# EAGLE design trickle2.bpcb (EAGLE 5.04)
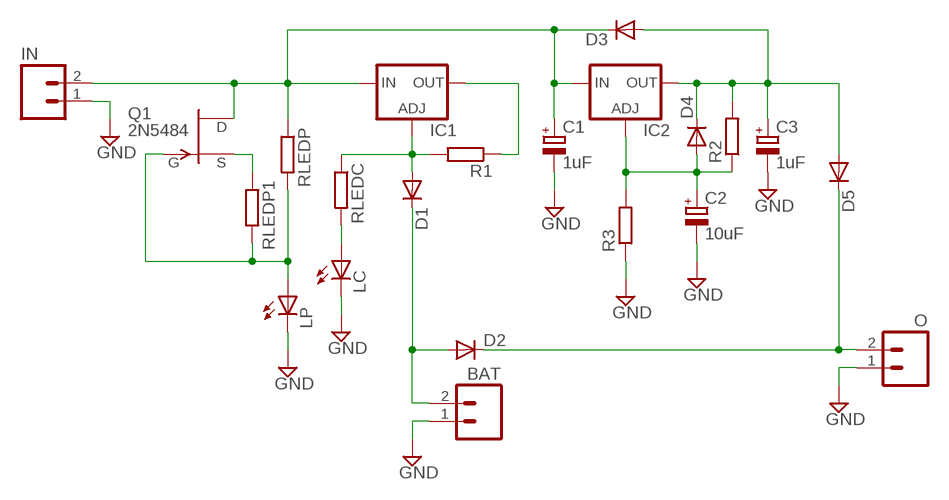
[diagram p0: schematic, sheet 1]

## Parts
BAT  M02PTH  [1X02]
C1  1uF  CPOL-EUE2.5-5  [E2,5-5]
C2  10uF  CPOL-EUE2.5-7  [E2,5-7]
C3  1uF  CPOL-EUE2.5-5  [E2,5-5]
D1  1N4446  [DO35-10]
D2  1N4446  [DO35-10]
D3  1N4446  [DO35-10]
D4  1N4446  [DO35-10]
D5  1N4446  [DO35-10]
IC1  LM317L  [317L]
IC2  LM317L  [317L]
IN  M02PTH  [1X02]
LC  LED3MM  [LED3MM]
LP  LED3MM  [LED3MM]
O  M02PTH  [1X02]
Q1  2N5484  2N3819  [TO92]
R1  R-EU_0207/10  [0207/10]
R2  R-EU_0207/10  [0207/10]
R3  R-EU_0207/10  [0207/10]
RLEDC  R-EU_0207/10  [0207/10]
RLEDP  R-EU_0207/10  [0207/10]
RLEDP1  R-EU_0207/10  [0207/10]

## Nets
GND: BAT.1 C1.- C2.- C3.- IN.1 LC.K(C) LP.K(C) O.1 R3.1
N$1: LP.A Q1.2(G) RLEDP1.2 RLEDP.2
N$2: LC.A RLEDC.2
N$3: BAT.2 D1.C D2.A
N$4: D1.A IC1.1(ADJ) R1.2 RLEDC.1
N$5: Q1.3(S) RLEDP1.1
N$6: D2.C D5.C O.2
N$7: C2.+ D4.A IC2.1(ADJ) R2.1 R3.2
N$9: IC1.2(OUT) R1.1
REG+: C3.+ D3.A D4.C D5.A IC2.2(OUT) R2.2
VCC: C1.+ D3.C IC1.3(IN) IC2.3(IN) IN.2 Q1.1(D) RLEDP.1

## Library data of the parts
BAT IN O = SparkFun:M02: Header 2 Standard 2-pin 0.1" header. Use with straight break away headers (SKU : PRT-00116), right angle break away headers (PRT-00553), swiss pins (PRT-00743), machine pins (PRT-00117), and female headers (PRT-00115). Molex polarized connector foot print use with SKU : PRT-08233 with associated crimp pins and housings.
C1-C3 = rcl:CPOL-EU: POLARIZED CAPACITOR, European symbol
D1-D5 = diode:1N4446: DIODE high speed (Philips)
IC1 IC2 = v-reg:LM317L: VOLTAGE REGULATOR
LC LP = led:LED: LED OSRAM: - CHIPLED LG R971, LG N971, LY N971, LG Q971, LY Q971, LO R971, LY R971 LH N974, LH R974 LS Q976, LO Q976, LY Q976 LO Q996 - Hyper CHIPLED LW Q18S LB Q993, LB Q99A, LB R99A - SideLED LS A670, LO A670, LY A670, LG A670, LP A670 LB A673, LV A673, LT A673, LW A673 LH A674 LY A675 LS A676, LA A676, LO A676, LY A676, LW A676 LS A679, LY A679, LG A679 - Hyper Micro SIDELED® LS Y876, LA Y876, LO Y876, LY Y876 LT Y87S - SmartLED LW L88C, LW L88S LB L89C, LB L89S, LG L890 LS L89K, LO L89K, LY L89K LS L896, LA L896, LO L896, LY L896 - TOPLED LS T670, LO T670, LY T670, LG T670, LP T670 LSG T670, LSP T670, LSY T670, LOP T670, LYG T670 LG T671, LOG T671, LSG T671 LB T673, LV T673, LT T673, LW T673 LH T674 LS T676, LA T676, LO T676, LY T676, LB T676, LH T676, LSB T676, LW T676 LB T67C, LV T67C, LT T67C, LS T67K, LO T67K, LY T67K, LW E67C LS E67B, LA E67B, LO E67B, LY E67B, LB E67C, LV E67C, LT E67C LW T67C LS T679, LY T679, LG T679 LS T770, LO T770, LY T770, LG T770, LP T770 LB T773, LV T773, LT T773, LW T773 LH T774 LS E675, LA E675, LY E675, LS T675 LS T776, LA T776, LO T776, LY T776, LB T776 LHGB T686 LT T68C, LB T68C - Hyper Mini TOPLED® LB M676 - Mini TOPLED Santana® LG M470 LS M47K, LO M47K, LY M47K Source: http://www.osram.convergy.de/
Q1 = transistor-fet:2N3819: N-Channel Junction FET
R1-R3 RLEDC RLEDP RLEDP1 = rcl:R-EU_: RESISTOR, European symbol

## Board
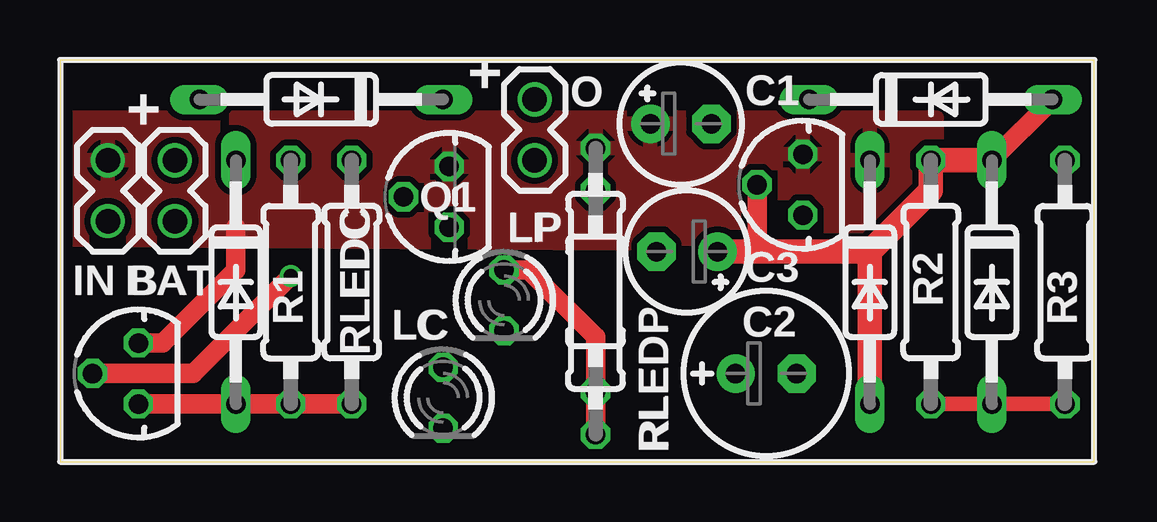
[diagram p1: board, top side]
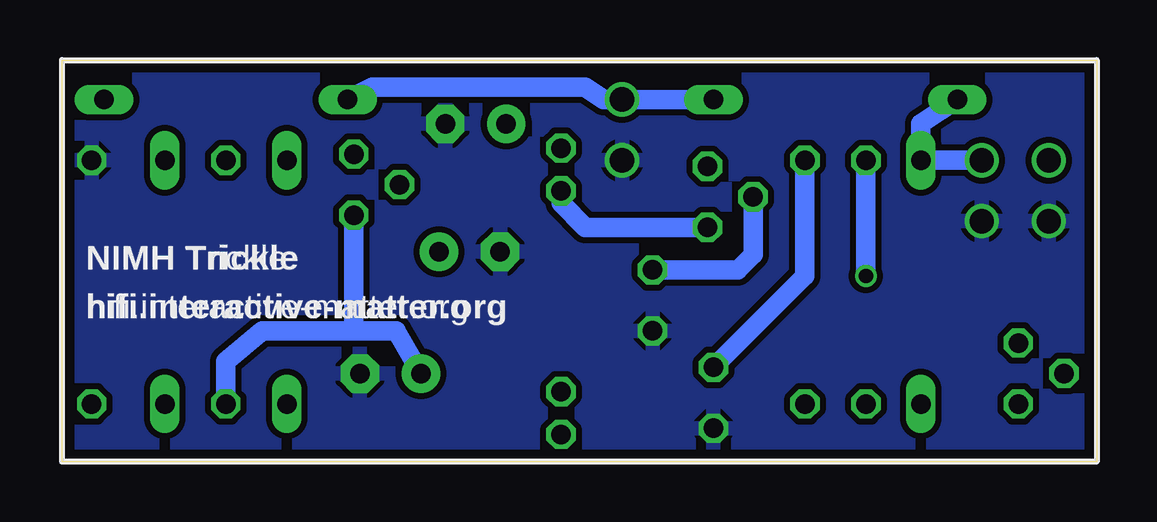
[diagram p2: board, bottom side, seen from below]

Size 43.1 x 16.75 mm. Coordinates in mm from the lower left corner, seen from the top.
Outline: 0,0 43.1,0 43.1,16.75 0,16.75 0,0
Copper layers (1*16): Top 0.035mm / dielectric 1.5mm / Bottom 0.035mm
Design rules "PCB-POOL": minimum track width 6mil, minimum drill 12mil, track to track 6mil, track to pad 6mil, pad to pad 6mil, via to via 6mil, smd to smd 6mil, copper to edge 20mil, drill to drill 8mil, minimum pad ring 8mil, minimum via ring 6mil, stop-mask expansion 3mil, vias tented up to drill 0mil, thermal gap 8mil

### Footprints (pad centres in the part's own frame; a part is rotated, then mirrored left to right if it is on the bottom)
1X02 = drill 1.016 round: 1 0,0; 2 2.54,0
E2,5-5 = drill 0.813 pad 1.6 round: + -1.27,0 | drill 0.813 pad 1.6 octagon: - 1.27,0
E2,5-7 = drill 0.813 pad 1.6 round: + -1.27,0 | drill 0.813 pad 1.6 octagon: - 1.27,0
DO35-10 = drill 0.813 long: A 5.08,0; C -5.08,0
317L = drill 0.813 octagon: 1 -1.27,0; 2 0,1.905; 3 1.27,0
LED3MM = drill 0.813 octagon: A -1.27,0; K 1.27,0
TO92 = drill 0.813 octagon: 1 1.27,0; 2 0,1.905; 3 -1.27,0
0207/10 = drill 0.813 octagon: 1 -5.08,0; 2 5.08,0

### Placement (x,y rotation side)
BAT  4.79,10.03 90 top
C1  25.87,14.09 0 top
C2  29.43,3.68 0 top
C3  26.12,8.76 180 top
D1  7.33,7.49 270 top
D2  10.88,15.11 180 top
D3  33.74,7.49 270 top
D4  38.82,7.49 270 top
D5  36.28,15.11 0 top
IC1  3.26,3.68 90 top
IC2  30.95,11.55 90 top
IN  1.99,10.03 90 top
LC  15.96,2.66 270 top
LP  18.5,6.73 270 top
O  19.77,12.57 90 top
Q1  16.22,11.04 90 top
R1  9.61,7.49 270 top
R2  36.28,7.49 90 top
R3  41.87,7.49 270 top
RLEDC  12.15,7.49 90 top
RLEDP  22.31,8 270 top
RLEDP1  22.31,6.22 270 top

### Tracks (layer width: path | path; a pad name or v marks a point on that pad's centre or on a via)
GND
  pour Bottom (isolate 0.254): -1.82,17.65 -1.82,-2.67 46.44,-2.67 46.44,17.65
N$1
  Top 0.813: RLEDP1.2 RLEDP.2 22.31,5.2 19.52,8 LP.A
  Bottom 0.813: Q1.2 14.31,8.63 14.95,8 LP.A
N$2
  Bottom 0.813: RLEDC.2 12.15,7.74 LC.A
N$3
  Bottom 0.813: D2.A 7.33,14.09 D1.C BAT.2
N$4
  Top 0.813: IC1.1 D1.A R1.2 RLEDC.1
N$5
  Bottom 0.813: RLEDP1.1 22.31,10.79 21.3,9.77 Q1.3
N$6
  Bottom 0.813: D2.C O.2 20.54,15.11 21.3,15.62 30.19,15.62 D5.C
N$7
  Top 0.61: R2.1 D4.A R3.2
  Bottom 0.813: R2.1 36.28,4.19 34.76,5.46 30.95,5.46 | 30.95,5.46 29.17,5.46 C2.+ | 30.95,5.46 IC2.1
N$9  (via drill 0.6)
  Top 0.813: IC1.2 5.55,3.68 v9.61,7.74
  Bottom 0.813: v9.61,7.74 R1.1
REG+
  Top 0.813: D4.C D5.A | IC2.2 29.05,9.14 28.66,8.76
  Top 1.016: 33.74,8.76 36.28,11.3 R2.2 D4.C | C3.+ 28.66,8.76 33.74,8.76 | 33.74,8.76 D3.A
VCC
  Top 0.813: IC1.3 4.28,4.95 7.33,8 7.33,9.77
  pour Top (isolate 0.254): -1.82,9.27 -1.82,14.35 36.54,14.35 36.54,9.01

### Text on the board
tNames: + | +
bNames: NIMH Trickle | hifi.interactive-matter.org
_tsilk: O | + | C1 | + | Q1 | LP | C3 | IN | BAT | R1 | R3 | RLEDP | R2 | RLEDC | LC | C2
_bsilk: NIMH Trickle | hifi.interactive-matter.org